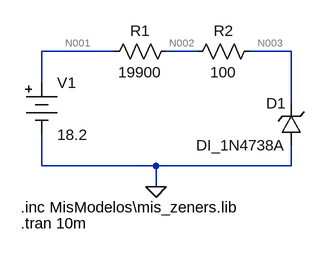
[diagram p0: schematic Zener1N4738ValoresComercialesCaso2.asc]
Zener1N4738ValoresComercialesCaso2.asc, the LTspice schematic file:
Version 4.1
SHEET 1 880 680
WIRE 128 80 16 80
WIRE 256 80 208 80
WIRE 400 80 336 80
WIRE 16 128 16 80
WIRE 400 160 400 80
WIRE 16 256 16 208
WIRE 192 256 16 256
WIRE 400 256 400 224
WIRE 400 256 192 256
WIRE 192 288 192 256
FLAG 192 288 0
SYMBOL Misc\\battery 16 112 R0
SYMATTR InstName V1
SYMATTR Value 18.2
SYMBOL res 224 64 R90
WINDOW 0 0 56 VBottom 2
WINDOW 3 32 56 VTop 2
SYMATTR InstName R1
SYMATTR Value 19900
SYMBOL res 352 64 R90
WINDOW 0 0 56 VBottom 2
WINDOW 3 32 56 VTop 2
SYMATTR InstName R2
SYMATTR Value 100
SYMBOL zener 416 224 R180
WINDOW 0 24 64 Left 2
WINDOW 3 24 0 Left 2
SYMATTR InstName D1
SYMATTR Value DI_1N4738A
SYMATTR Prefix x
TEXT -16 320 Left 2 !.inc MisModelos\\mis_zeners.lib
TEXT -16 344 Left 2 !.tran 10m

The netlist it stands for:
* Zener1N4738ValoresComercialesCaso2.asc
V1 N001 0 18.2
R1 N002 N001 19900
R2 N003 N002 100
X§D1 0 N003 DI_1N4738A  ; pins + -
.inc MisModelos\mis_zeners.lib
.tran 10m
.backanno
.end

* Results of the author's LTspice run, read from the files saved beside the schematic
* Operating Point, zero values left out:
*   V(n001) = 18.2 V
*   V(n002) = 8.114 V
*   V(n003) = 8.063 V
*   I(R1) = -506.8 µA
*   I(R2) = -506.8 µA
*   I(V1) = -506.8 µA
*   Ix(d1:1) = -506.8 µA
*   Ix(d1:2) = 506.8 µA